# EAGLE design handpiece (EAGLE 6.4)
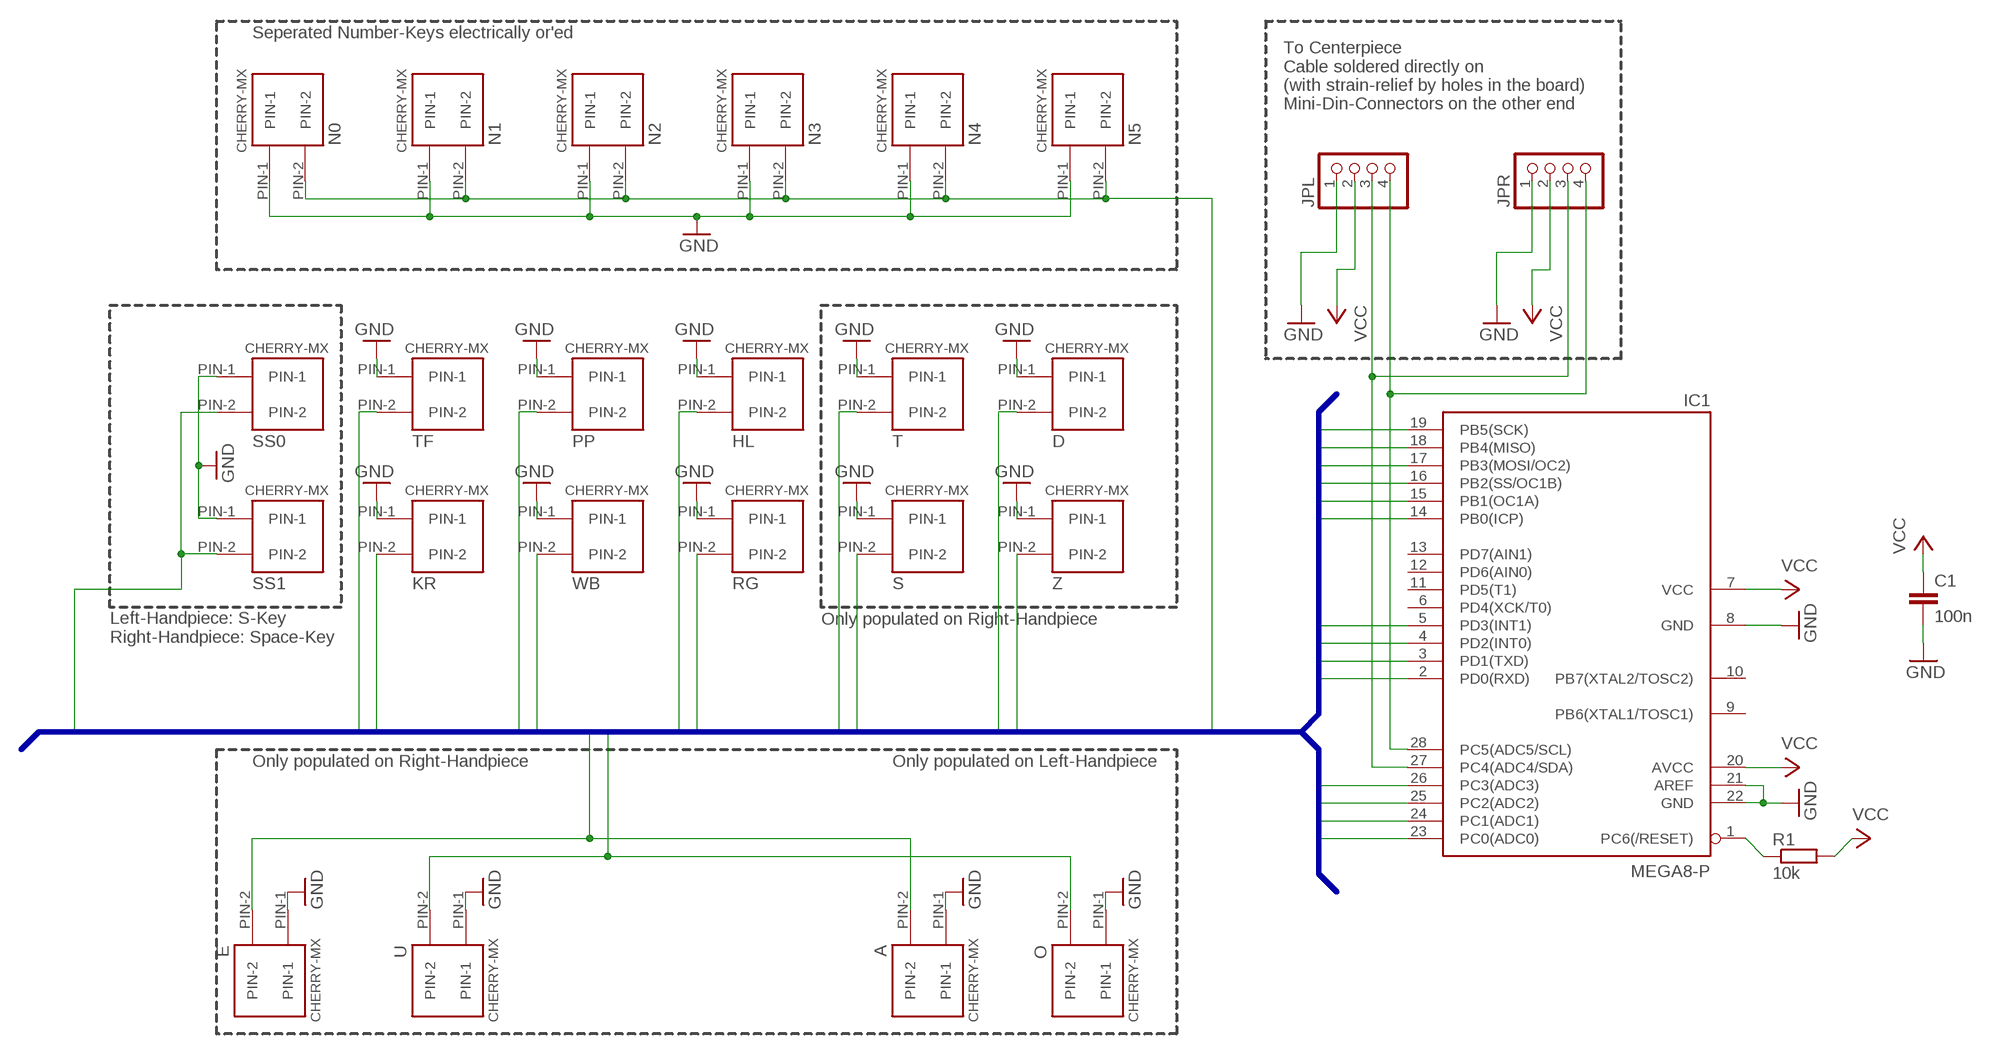
[diagram p0: schematic, sheet 1]

## Parts
A  CHERRY-MX-I  [CHERRY-MX-I]
C1  100n  C-EU075-032X103  [C075-032X103]
D  CHERRY-MX-I  [CHERRY-MX-I]
E  CHERRY-MX-I  [CHERRY-MX-I]
HL  CHERRY-MX-I  [CHERRY-MX-I]
IC1  MEGA8-P  [DIL28-3]
JPL  PINHD-1X4  [1X04]
JPR  PINHD-1X4  [1X04]
KR  CHERRY-MX-I  [CHERRY-MX-I]
N0  CHERRY-MX-I  [CHERRY-MX-I]
N1  CHERRY-MX-I  [CHERRY-MX-I]
N2  CHERRY-MX-I  [CHERRY-MX-I]
N3  CHERRY-MX-I  [CHERRY-MX-I]
N4  CHERRY-MX-I  [CHERRY-MX-I]
N5  CHERRY-MX-I  [CHERRY-MX-I]
O  CHERRY-MX-I  [CHERRY-MX-I]
PP  CHERRY-MX-I  [CHERRY-MX-I]
R1  10k  R-EU_0207/7  [0207/7]
RG  CHERRY-MX-I  [CHERRY-MX-I]
S  CHERRY-MX-I  [CHERRY-MX-I]
SS0  CHERRY-MX-I  [CHERRY-MX-I]
SS1  CHERRY-MX-I  [CHERRY-MX-I]
T  CHERRY-MX-I  [CHERRY-MX-I]
TF  CHERRY-MX-I  [CHERRY-MX-I]
U  CHERRY-MX-I  [CHERRY-MX-I]
WB  CHERRY-MX-I  [CHERRY-MX-I]
Z  CHERRY-MX-I  [CHERRY-MX-I]

## Nets
D: D.PIN-2 IC1.15(PB1(OC1A))
EA: A.PIN-2 E.PIN-2 IC1.4(PD2(INT0))
GND: A.PIN-1 C1.2 D.PIN-1 E.PIN-1 HL.PIN-1 IC1.8(GND) IC1.21(AREF) IC1.22(GND) JPL.1 JPR.1 KR.PIN-1 N0.PIN-1 N1.PIN-1 N2.PIN-1 N3.PIN-1 N4.PIN-1 N5.PIN-1 O.PIN-1 PP.PIN-1 RG.PIN-1 S.PIN-1 SS0.PIN-1 SS1.PIN-1 T.PIN-1 TF.PIN-1 U.PIN-1 WB.PIN-1 Z.PIN-1
HL: HL.PIN-2 IC1.23(PC0(ADC0))
KR: IC1.2(PD0(RXD)) KR.PIN-2
N: IC1.14(PB0(ICP)) N0.PIN-2 N1.PIN-2 N2.PIN-2 N3.PIN-2 N4.PIN-2 N5.PIN-2
N$2: IC1.1(PC6(/RESET)) R1.1
OU: IC1.5(PD3(INT1)) O.PIN-2 U.PIN-2
PP: IC1.24(PC1(ADC1)) PP.PIN-2
RG: IC1.19(PB5(SCK)) RG.PIN-2
S: IC1.17(PB3(MOSI/OC2)) S.PIN-2
SCL: IC1.28(PC5(ADC5/SCL)) JPL.4 JPR.4
SDA: IC1.27(PC4(ADC4/SDA)) JPL.3 JPR.3
SS: IC1.3(PD1(TXD)) SS0.PIN-2 SS1.PIN-2
T: IC1.18(PB4(MISO)) T.PIN-2
TF: IC1.26(PC3(ADC3)) TF.PIN-2
VCC: C1.1 IC1.7(VCC) IC1.20(AVCC) JPL.2 JPR.2 R1.2
WB: IC1.25(PC2(ADC2)) WB.PIN-2
Z: IC1.16(PB2(SS/OC1B)) Z.PIN-2
Unconnected: IC1.6(PD4(XCK/T0)) IC1.9(PB6(XTAL1/TOSC1)) IC1.10(PB7(XTAL2/TOSC2)) IC1.11(PD5(T1)) IC1.12(PD6(AIN0)) IC1.13(PD7(AIN1))

## Buses
KEYS:SS,N,TF,KR,PP,WB,HL,RG,T,S,D,Z,EA,OU

## Notes on the sheet
- Seperated Number-Keys electrically or'ed
- To Centerpiece
  Cable soldered directly on
  (with strain-relief by holes in the board)
  Mini-Din-Connectors on the other end
- Only populated on Right-Handpiece
- Left-Handpiece: S-Key
  Right-Handpiece: Space-Key
- Only populated on Right-Handpiece | Only populated on Left-Handpiece

## Library data of the parts
A D E HL KR N0 N1-N5 O PP RG S SS0 SS1 T TF U WB Z = cherrymx:CHERRY-MX-I
C1 = rcl:C-EU: CAPACITOR, European symbol
IC1 = atmel:MEGA8-P: MICROCONTROLLER 8 Kbytes FLASH, 1 kbytes SRAM, 512 bytes EEPROM, USART, 4-channel 10 bit ADC, 2-channel 8 bit ADC Pin compatible with Atmega48, ATMega88, ATMega168 Source: avr.lbr; OC_FARNELL: unknown; OC_NEWARK: unknown
JPL JPR = pinhead:PINHD-1X4: PIN HEADER
R1 = rcl:R-EU_: RESISTOR, European symbol

## Board
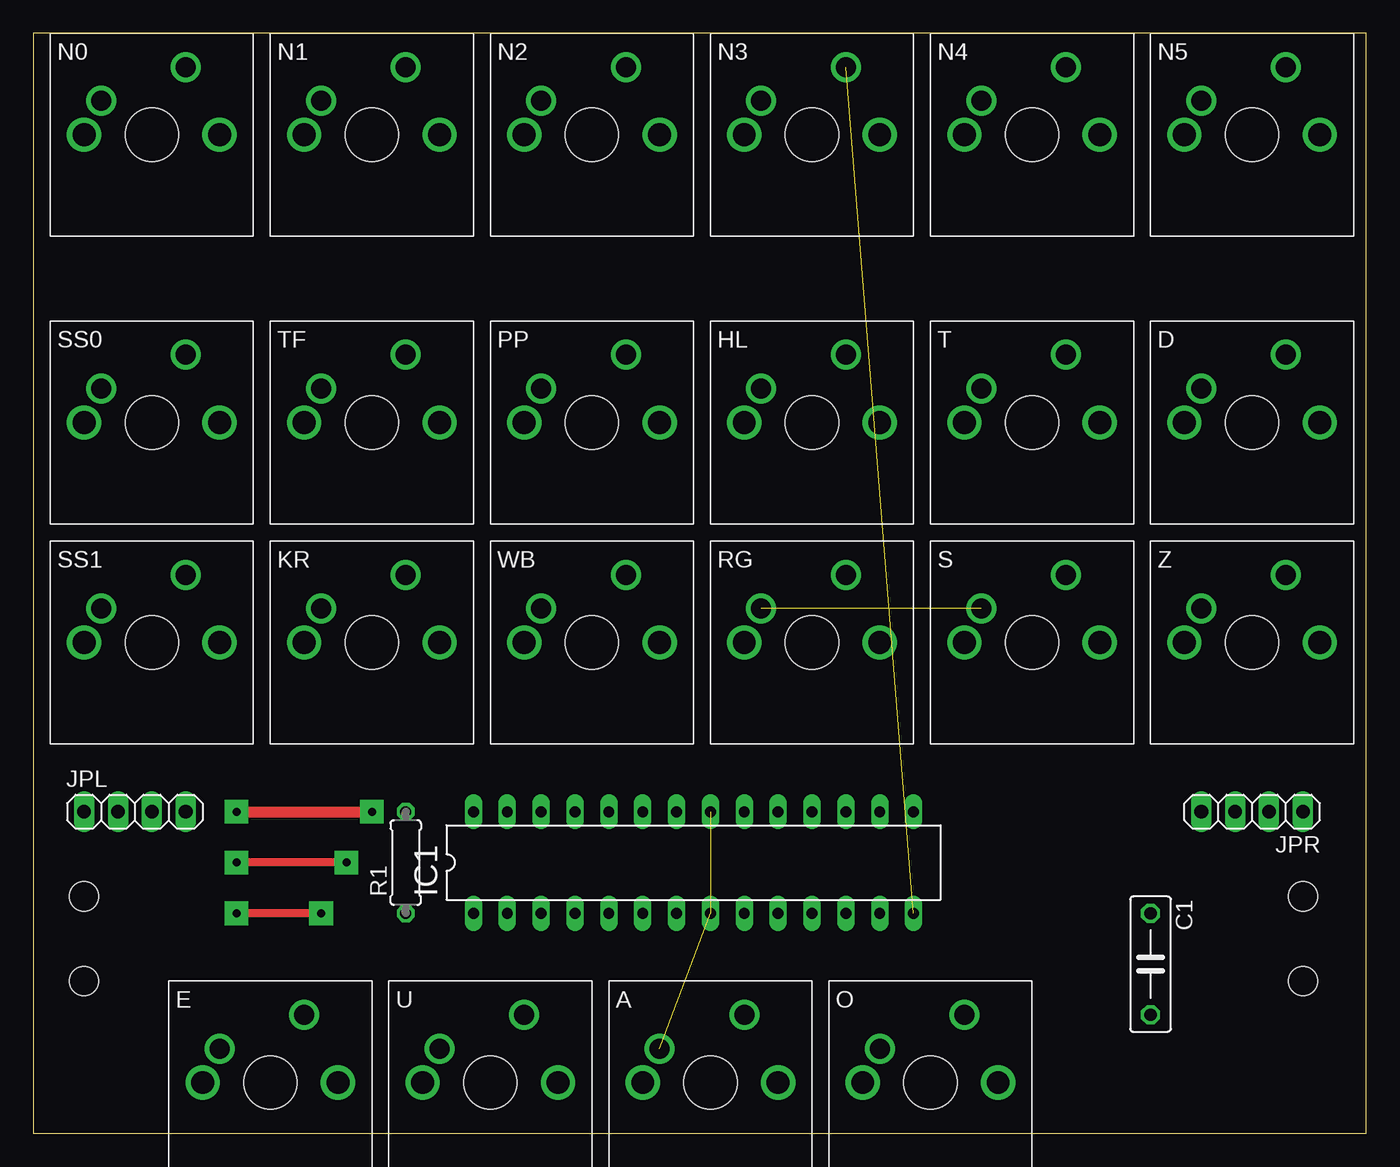
[diagram p1: board, top side]
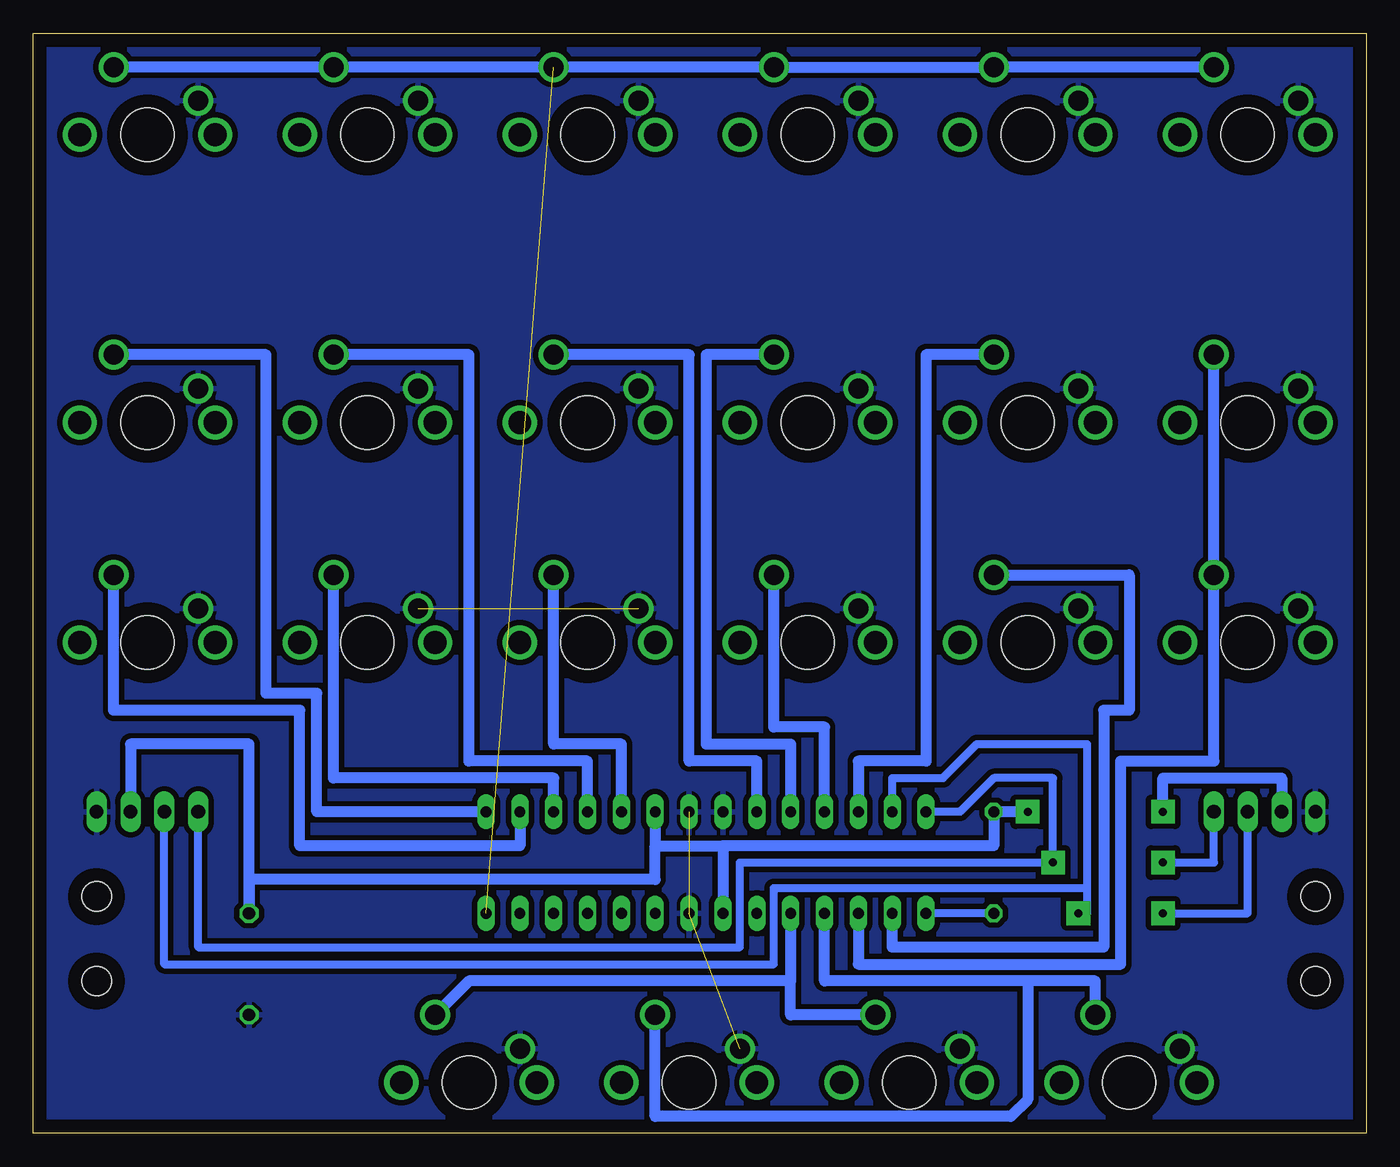
[diagram p2: board, bottom side, seen from below]

Size 100 x 82.54 mm. Coordinates in mm from the lower left corner, seen from the top.
Outline: 0,0 100,0 100,82.54 0,82.54 0,0
Copper layers (1*16): Top 0.035mm / dielectric 1.5mm / Bottom 0.035mm
Design rules "default": minimum track width 10mil, minimum drill 24mil, track to track 8mil, track to pad 8mil, pad to pad 8mil, via to via 8mil, smd to smd 8mil, copper to edge 40mil, drill to drill 8mil, minimum pad ring 10mil, minimum via ring 8mil, stop-mask expansion 4mil, vias tented up to drill 0mil, thermal gap 10mil
Holes 2.2 mm at 3.81,17.78 3.81,11.43 95.25,17.78 95.25,11.43

### Footprints (pad centres in the part's own frame; a part is rotated, then mirrored left to right if it is on the bottom)
CHERRY-MX-I = drill 1.714 pad 1.778: P$3 -5.08,0; P$4 5.08,0 | drill 1.5 pad 2.184: PIN-1 -3.81,2.54; PIN-2 2.54,5.08 | hole 4: 0,0
C075-032X103 = drill 0.914 octagon: 1 -3.81,0; 2 3.81,0
DIL28-3 = drill 0.813 long: 1 -16.51,-3.81; 2 -13.97,-3.81; 3 -11.43,-3.81; 4 -8.89,-3.81; 5 -6.35,-3.81; 6 -3.81,-3.81; 7 -1.27,-3.81; 8 1.27,-3.81; 9 3.81,-3.81; 10 6.35,-3.81; 11 8.89,-3.81; 12 11.43,-3.81; 13 13.97,-3.81; 14 16.51,-3.81; 15 16.51,3.81; 16 13.97,3.81; 17 11.43,3.81; 18 8.89,3.81; 19 6.35,3.81; 20 3.81,3.81; 21 1.27,3.81; 22 -1.27,3.81; 23 -3.81,3.81; 24 -6.35,3.81; 25 -8.89,3.81; 26 -11.43,3.81; 27 -13.97,3.81; 28 -16.51,3.81
1X04 = drill 1.016 long: 1 -3.81,0; 2 -1.27,0; 3 1.27,0; 4 3.81,0
0207/7 = drill 0.813 octagon: 1 -3.81,0; 2 3.81,0

### Placement (x,y rotation side)
A  50.8,3.81 0 top
C1  83.82,12.7 270 top
D  91.44,53.34 0 top
E  17.78,3.81 0 top
HL  58.42,53.34 0 top
IC1  49.53,20.32 0 top
JPL  7.62,24.13 0 top
JPR  91.44,24.13 180 top
KR  25.4,36.83 0 top
N0  8.89,74.93 0 top
N1  25.4,74.93 0 top
N2  41.91,74.93 0 top
N3  58.42,74.93 0 top
N4  74.93,74.93 0 top
N5  91.44,74.93 0 top
O  67.31,3.81 0 top
PP  41.91,53.34 0 top
R1  27.94,20.32 90 top
RG  58.42,36.83 0 top
S  74.93,36.83 0 top
SS0  8.89,53.34 0 top
SS1  8.89,36.83 0 top
T  74.93,53.34 0 top
TF  25.4,53.34 0 top
U  34.29,3.81 0 top
WB  41.91,36.83 0 top
Z  91.44,36.83 0 top

### Tracks (layer width: path | path; a pad name or v marks a point on that pad's centre or on a via)
D
  Bottom 0.813: IC1.15 78.74,24.13 78.74,33.02 82.55,33.02 82.55,58.42 D.PIN-2
EA
  Bottom 0.813: E.PIN-2 20.32,11.43 25.4,11.43 | 25.4,11.43 40.64,11.43 IC1.4 | 25.4,11.43 25.4,2.54 26.67,1.27 53.34,1.27 A.PIN-2
GND  (3 unrouted)
  pour Bottom (isolate 0.406): 0,82.55 100,82.55 100,0 0,0
HL
  Bottom 0.813: IC1.23 45.72,27.94 50.8,27.94 50.8,58.42 HL.PIN-2
KR
  Bottom 0.813: KR.PIN-2 17.78,41.91 17.78,31.75 19.68,31.75 19.68,13.97 35.56,13.97 IC1.2
N  (1 unrouted)
  Bottom 0.813: N0.PIN-2 N1.PIN-2 N2.PIN-2 N3.PIN-2 N4.PIN-2 N5.PIN-2
N$2
  Bottom 0.61: R1.1 IC1.1
OU
  Bottom 0.813: U.PIN-2 43.18,8.89 43.18,11.43 | 43.18,11.43 67.31,11.43 O.PIN-2 | IC1.5 43.18,11.43
PP
  Bottom 0.813: PP.PIN-2 49.53,58.42 49.53,29.21 43.18,29.21 IC1.24
RG
  Bottom 0.813: IC1.19 55.88,29.21 60.96,29.21 RG.PIN-2
S
  Bottom 0.813: IC1.17 60.96,26.67 77.47,26.67 S.PIN-2
SCL  (via drill 0.6 pad 1.78)
  Top 0.61: v23.5,20.32 v15.24,20.32
  Bottom 0.61: IC1.28 30.48,24.13 27.94,26.67 23.5,26.67 v23.5,20.32 46.99,20.32 46.99,13.97 87.63,13.97 JPR.4 | v15.24,20.32 11.43,20.32 JPL.4
SDA  (via drill 0.6 pad 1.78)
  Top 0.61: v21.59,16.51 v15.24,16.51
  Bottom 0.61: 20.95,18.41 44.45,18.41 44.45,12.7 90.17,12.7 JPR.3 | IC1.27 35.56,26.67 31.75,26.67 29.21,29.21 20.95,29.21 20.95,18.41 | 20.95,18.41 20.95,16.51 v21.59,16.51 | v15.24,16.51 8.89,16.51 JPL.3
SS
  Bottom 0.813: SS0.PIN-2 SS1.PIN-2 11.43,27.94 18.41,27.94 18.41,12.7 38.1,12.7 IC1.3
T
  Bottom 0.813: IC1.18 58.42,27.94 67.31,27.94 67.31,58.42 T.PIN-2
TF
  Bottom 0.813: TF.PIN-2 33.02,58.42 33.02,27.94 38.1,27.94 IC1.26
VCC  (via drill 0.6 pad 1.78)
  Top 0.813: v15.24,24.13 v25.4,24.13
  Bottom 0.813: 48.26,21.59 27.94,21.59 R1.2 v25.4,24.13 | 48.26,21.59 IC1.7 | IC1.20 53.34,21.59 | 53.34,21.59 53.34,19.05 83.82,19.05 C1.1 83.82,29.21 92.71,29.21 JPR.2 | 53.34,21.59 48.26,21.59 | v15.24,24.13 15.24,26.67 6.35,26.67 JPL.2
WB
  Bottom 0.813: IC1.25 40.64,30.48 44.45,30.48 WB.PIN-2
Z
  Bottom 0.813: IC1.16 63.5,21.59 80.01,21.59 80.01,31.75 93.98,31.75 Z.PIN-2